# EasyEDA schematic easyeda.json

## Sheets
1 Smart Parking: TITLE: Smart Parking; REV: 1.0; Date: 2019-10-22; Sheet: 1/1; Drawn By: Simen Stensås; Company: NTNU
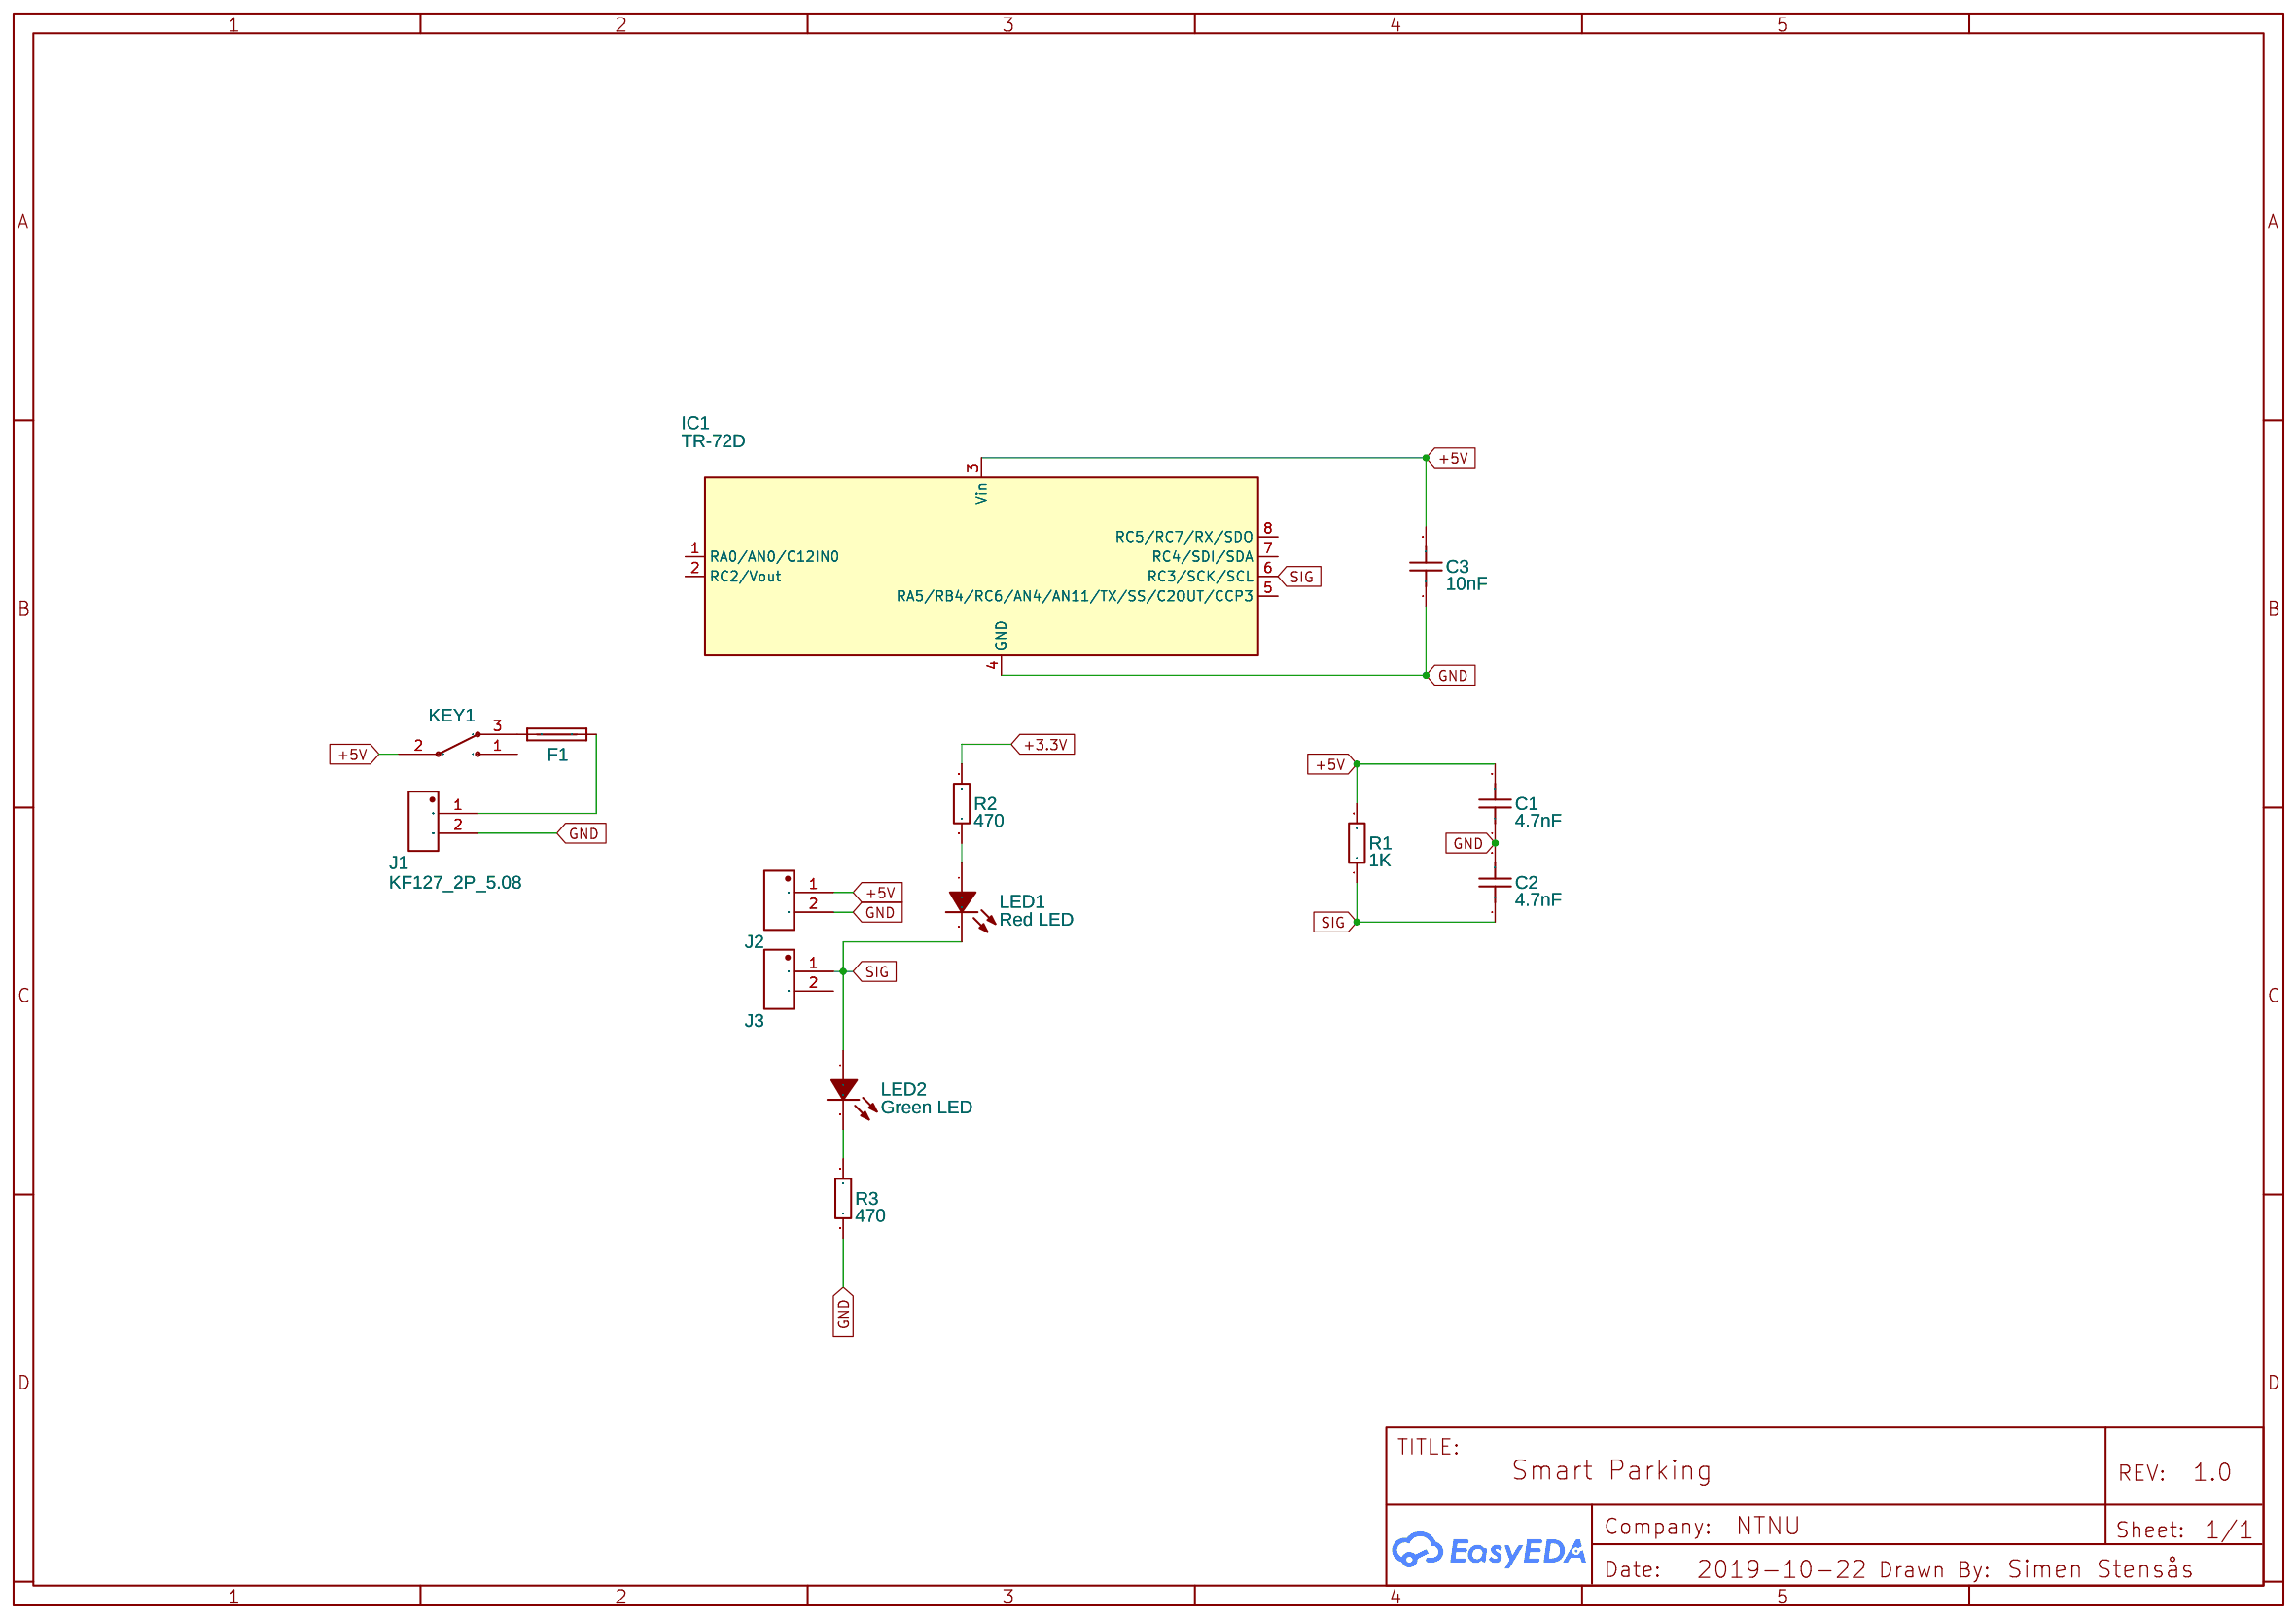
[diagram p0: Smart Parking]
2 Smart Parking Screen: TITLE: Smart Parking Screen; Date: 2019-10-31
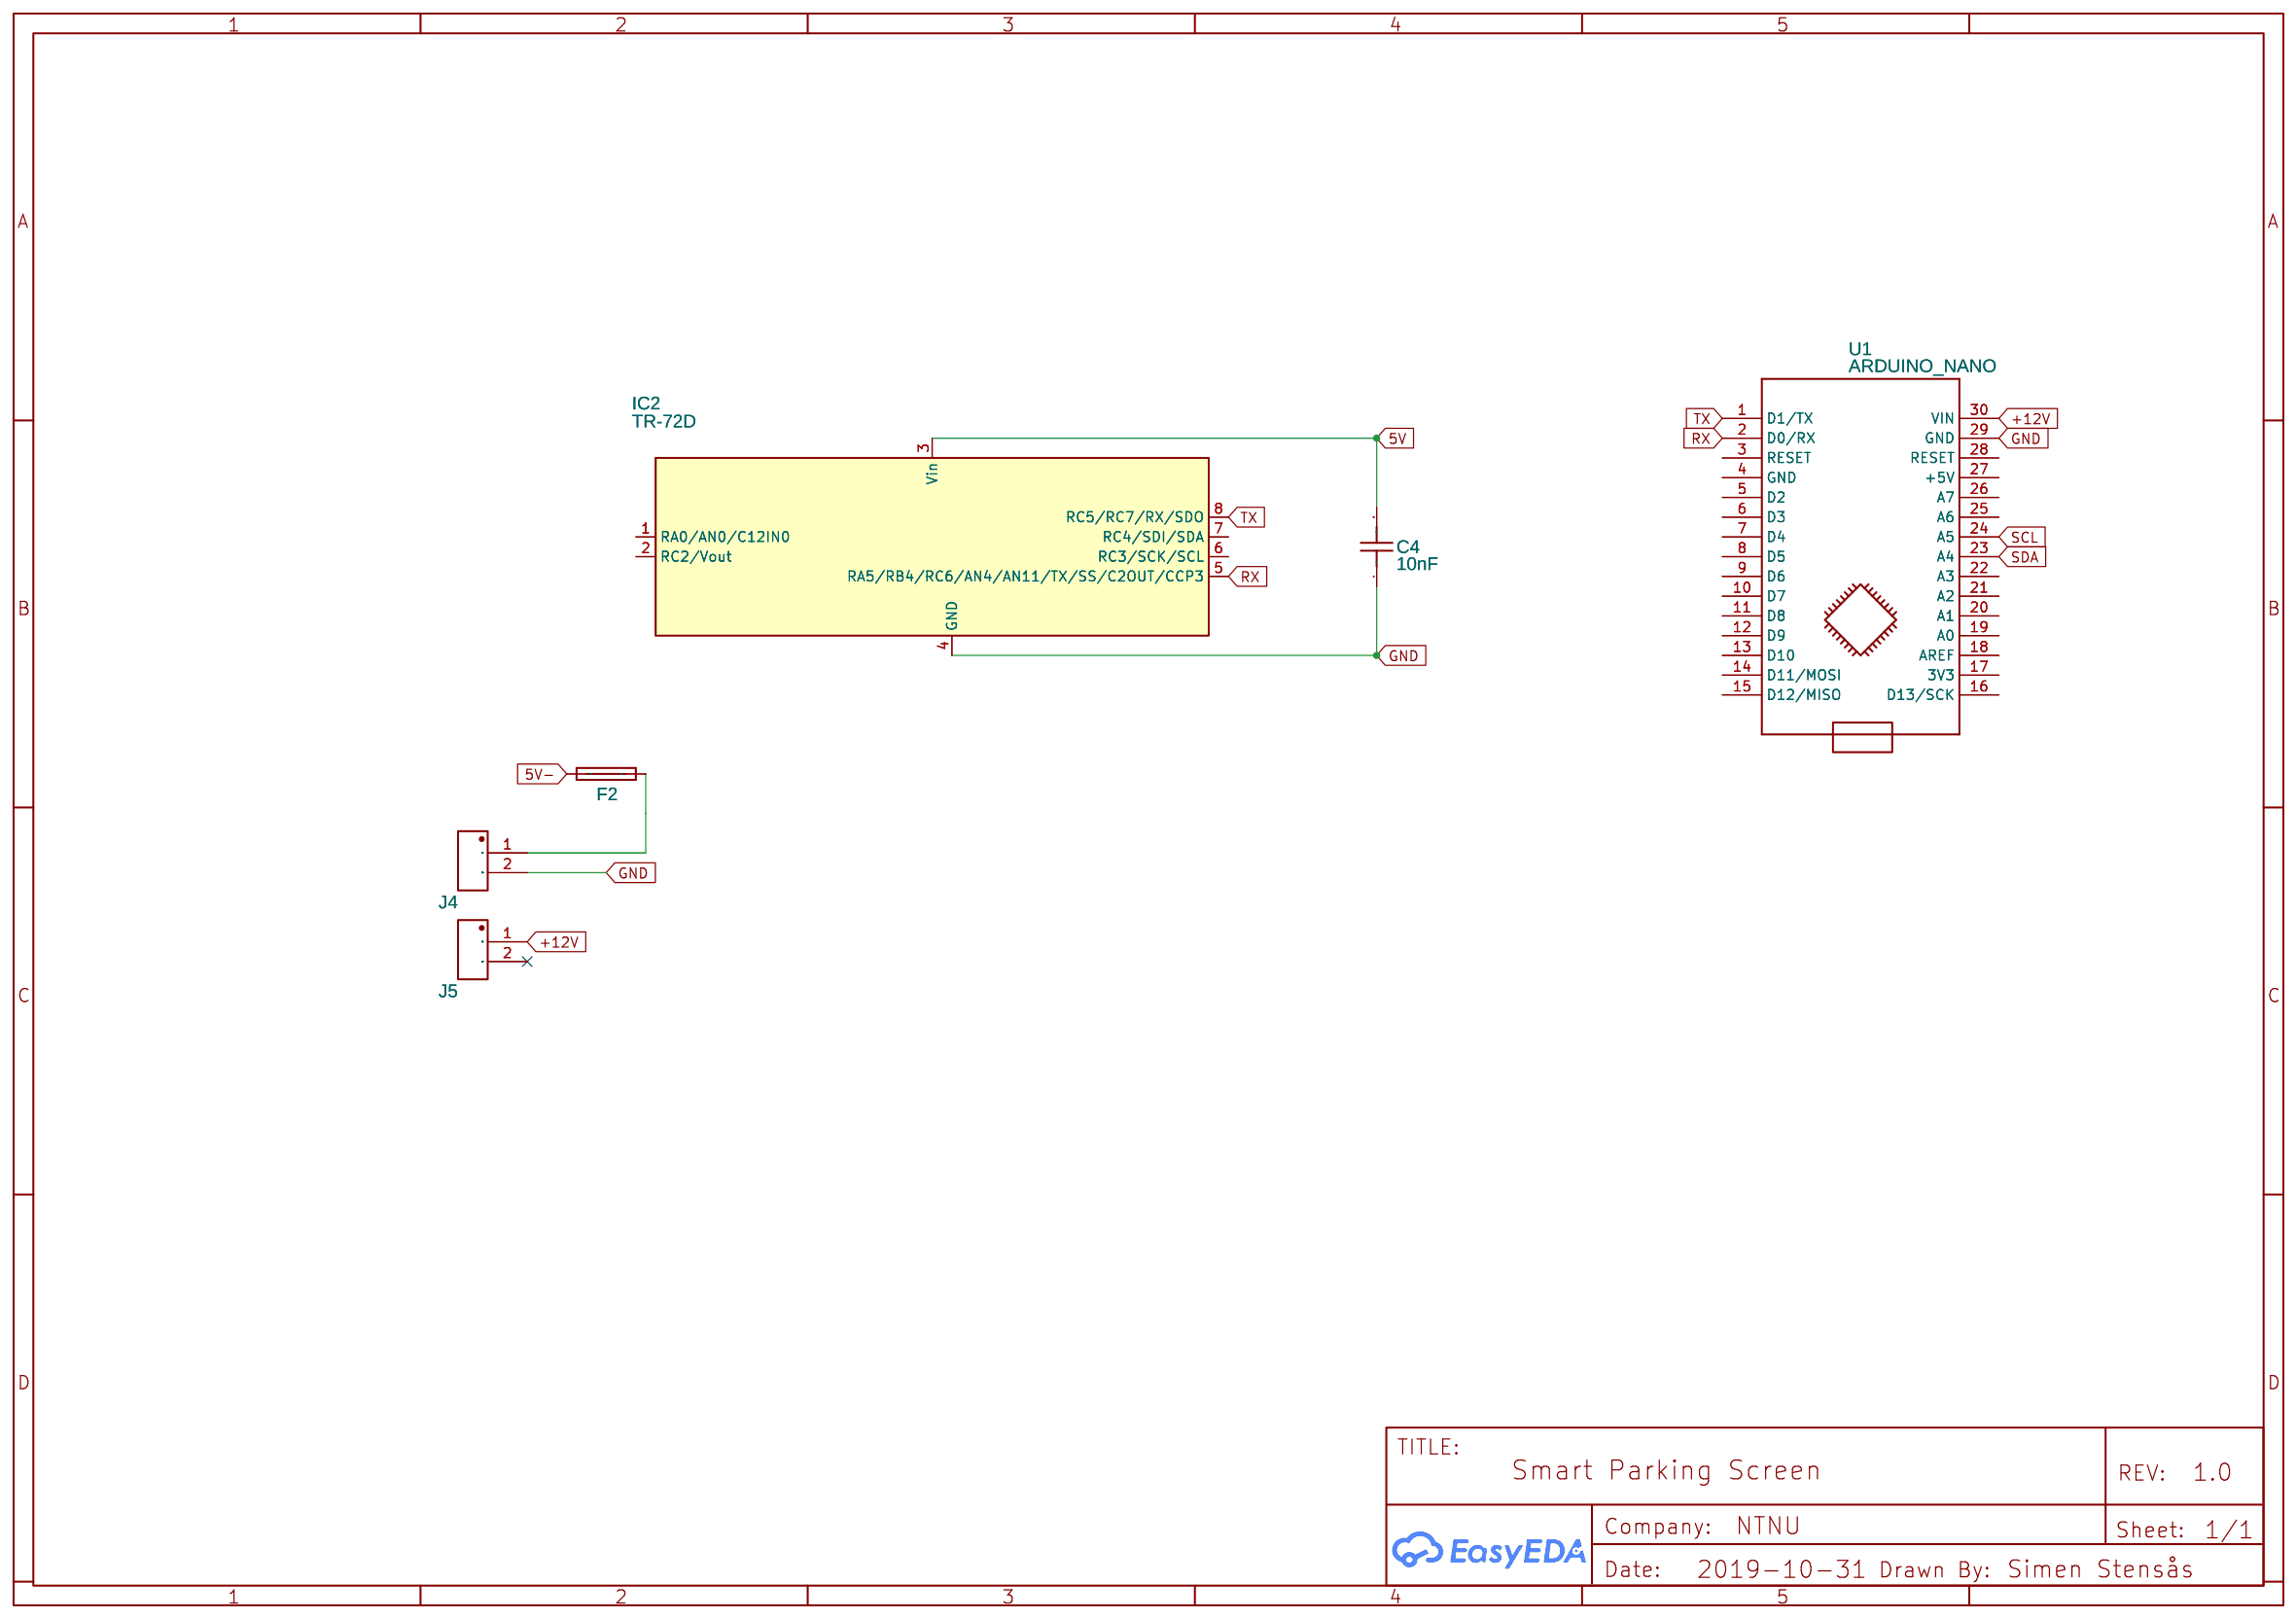
[diagram p1: Smart Parking Screen]

## Parts
sheet Smart Parking Screen
C4  10nF  [0603]
F2  NO  [OMF_125]
IC2  TR-72D  [IQRF_KON-SIM-01]
J4  KF127_2P_5.08  [KF127_2P_5.08]
J5  KF127_2P_5.08  [KF127_2P_5.08]
U1  ARDUINO_NANO  [ARDUINO_NANO]
sheet Smart Parking
C1  4.7nF  [0805]
C2  4.7nF  [0805]
C3  10nF  [0603]
F1  NO  [OMF_125]
IC1  TR-72D  [IQRF_KON-SIM-01]
J1  KF127_2P_5.08  [KF127_2P_5.08]
J2  KF127_2P_5.08  [KF127_2P_5.08]
J3  KF127_2P_5.08  [KF127_2P_5.08]
KEY1  MSK-11027 Toggle Switches  [MSK-11027]
LED1  Red LED  [LED-SMD_L3.5-W2.8-R-RD]
LED2  Green LED  [LED-SMD_L3.5-W2.8-R-RD]
R1  1K  [0805]
R2  470  [0805]
R3  470  [0805]

## Library data of the parts
C3 C4 = 0603B103K500AT: Supplier: LCSC; Supplier Part: C327421; Manufacturer: Guangdong Fenghua Advanced Tech; Contributor: LCSC
F1 F2 = -: Manufacturer Part: 3403.0015.11; Supplier: Mouser; Supplier Part: 693-3403.0015.11; link: https://www.mouser.co.uk/ProductDetail/Schurter/3403001511?qs=sGAEpiMZZMtxU2g%2f1juGqdRmCQF0%252bT4VUkZkHB0fJk4%3d; Contributor: romiksm
IC1 IC2 = -: Contributor: Simen Stensas; license: https://www.gnu.org/licenses/lgpl-2.1.html
J1-J5 = -: Manufacturer: Kefa Electronics; Manufacturer Part: KF127L-5.08; Contributor: GrahamG
U1 = -: sourceId: KGSeAWhDB
C1 C2 = 0805B472K201: Supplier: LCSC; Manufacturer: WTC; Supplier Part: C77474
KEY1 = -: Supplier Part: C21381; Supplier: LCSC; Manufacturer: ReliaPro; image: http://image.lceda.cn/szlcsc/C21381.jpg
LED1 LED2 = -: Supplier: LCSC; Manufacturer: KENTO; Manufacturer Part: 3528 Red LED; image: //image.lceda.cn/szlcsc/C2305.jpg; Supplier Part: C2305; LCSC Assembly: Yes; SMT Type: Extend
R1-R3 = CR0805J80102G: Supplier: LCSC; Supplier Part: C101925; Manufacturer: LIZ Elec; Contributor: LCSC

## Nets
5V: C4.2 IC2.3(Vin)
5V-: F2.1
+3.3V: R2.2
+5V: C1.2 C3.2 IC1.3(Vin) J2.1(PIN1) KEY1.2 R1.2
+12V: J5.1(PIN1) U1.30(VIN)
GND: C1.1 C2.2 C3.1 C4.1 IC1.4(GND) IC2.4(GND) J1.2(PIN2) J2.2(PIN2) J4.2(PIN2) R3.1 U1.29(GND)
RX: IC2.5(RA5/RB4/RC6/AN4/AN11/TX/SS/C2OUT/CCP3) U1.2(D0/RX)
SCL: U1.24(A5)
SDA: U1.23(A4)
SIG: C2.1 IC1.6(RC3/SCK/SCL) J3.1(PIN1) LED1.2(K) LED2.1(A) R1.1
TX: IC2.8(RC5/RC7/RX/SDO) U1.1(D1/TX)
Net-(F1-1): F1.1 KEY1.3
Net-(F1-2): F1.2 J1.1(PIN1)
Net-(F2-2): F2.2 J4.1(PIN1)
Net-(LED1-1): LED1.1(A) R2.1
Net-(LED2-2): LED2.2(K) R3.2

Not connected (* = marked no-connect by the designer): IC1 1(RA0/AN0/C12IN0) 2(RC2/Vout) 5(RA5/RB4/RC6/AN4/AN11/TX/SS/C2OUT/CCP3) 7(RC4/SDI/SDA) 8(RC5/RC7/RX/SDO); IC2 1(RA0/AN0/C12IN0) 2(RC2/Vout) 6(RC3/SCK/SCL) 7(RC4/SDI/SDA); J3 2(PIN2); J5 2(PIN2)*; KEY1 1; U1 3(RESET) 4(GND) 5(D2) 6(D3) 7(D4) 8(D5) 9(D6) 10(D7) 11(D8) 12(D9) 13(D10) 14(D11/MOSI) 15(D12/MISO) 16(D13/SCK) 17(3V3) 18(AREF) 19(A0) 20(A1) 21(A2) 22(A3) 25(A6) 26(A7) 27(+5V) 28(RESET)
